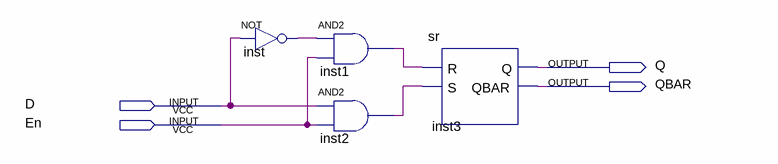
[diagram p0: schematic sheet]
// Quartus schematic dlatch1911.bdf as structural Verilog: 4 symbols, 4 pins
module dlatch1911 (
  input  D,
  input  En,
  output Q,
  output QBAR
);

  wire inst1_out, inst2_out, inst_out;

  not inst (inst_out, D);
  and inst1 (inst1_out, inst_out, En);
  and inst2 (inst2_out, D, En);
  sr inst3 (.R(inst1_out), .S(inst2_out), .Q(Q), .QBAR(QBAR));
endmodule
